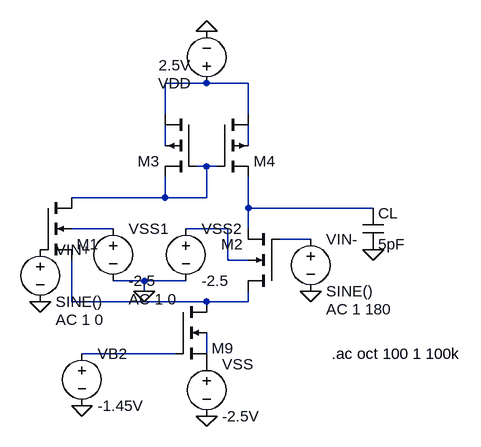
[diagram p0: schematic Jiayi_Feng_2288941F.asc]
Jiayi_Feng_2288941F.asc, the LTspice schematic file:
Version 4
SHEET 1 880 680
WIRE 304 -80 240 -80
WIRE 368 -80 304 -80
WIRE 240 -32 240 -80
WIRE 368 -32 368 -80
WIRE 240 16 240 -16
WIRE 368 16 368 -16
WIRE 304 48 288 48
WIRE 320 48 304 48
WIRE 240 96 240 64
WIRE 240 96 96 96
WIRE 304 96 304 48
WIRE 304 96 240 96
WIRE 368 112 368 64
WIRE 560 112 368 112
WIRE 160 144 96 144
WIRE 336 144 272 144
WIRE 368 144 368 112
WIRE 464 160 416 160
WIRE 336 192 336 144
WIRE 368 192 336 192
WIRE 208 224 160 224
WIRE 272 224 208 224
WIRE 208 240 208 224
WIRE 96 256 96 192
WIRE 304 256 96 256
WIRE 368 256 368 240
WIRE 368 256 304 256
WIRE 256 336 112 336
WIRE 304 336 304 304
FLAG 304 432 0
FLAG 48 256 0
FLAG 304 -160 0
FLAG 464 240 0
FLAG 112 416 0
FLAG 560 176 0
FLAG 208 240 0
SYMBOL cap 544 112 R0
SYMATTR InstName CL
SYMATTR Value 5pF
SYMBOL voltage 304 -64 R180
WINDOW 3 24 44 Left 2
WINDOW 123 0 0 Left 2
WINDOW 39 0 0 Left 2
SYMATTR Value 2.5V
SYMATTR InstName VDD
SYMBOL voltage 304 336 R0
WINDOW 123 0 0 Left 2
WINDOW 39 0 0 Left 2
SYMATTR InstName VSS
SYMATTR Value -2.5V
SYMBOL voltage 48 160 R0
WINDOW 123 24 124 Left 2
WINDOW 39 0 0 Left 2
SYMATTR InstName VIN+
SYMATTR Value SINE()
SYMATTR Value2 AC 1 0
SYMBOL voltage 464 144 R0
WINDOW 123 24 124 Left 2
WINDOW 39 0 0 Left 2
SYMATTR Value2 AC 1 180
SYMATTR InstName VIN-
SYMATTR Value SINE()
SYMBOL voltage 112 320 R0
WINDOW 123 0 0 Left 2
WINDOW 39 0 0 Left 2
SYMATTR InstName VB2
SYMATTR Value -1.45V
SYMBOL pmos4 288 -32 M0
WINDOW 0 56 32 Invisible 2
SYMATTR InstName M5
SYMATTR Value M3
SYMBOL pmos4 320 -32 R0
WINDOW 0 56 32 Invisible 2
SYMATTR InstName M1
SYMATTR Value M4
SYMATTR Value2 l=1.5um w=23um
SYMBOL nmos4 48 96 R0
WINDOW 0 56 32 Invisible 2
SYMATTR InstName M2
SYMATTR Value M1
SYMBOL nmos4 416 240 R180
WINDOW 0 56 32 Invisible 2
SYMATTR InstName M3
SYMATTR Value M2
SYMBOL nmos4 256 256 R0
WINDOW 0 56 32 Invisible 2
SYMATTR InstName M4
SYMATTR Value M9
SYMBOL voltage 160 128 R0
WINDOW 123 24 124 Left 2
WINDOW 39 0 0 Left 2
SYMATTR InstName VSS1
SYMATTR Value -2.5
SYMATTR Value2 AC 1 0
SYMBOL voltage 272 128 R0
WINDOW 123 0 0 Left 2
WINDOW 39 0 0 Left 2
SYMATTR InstName VSS2
SYMATTR Value -2.5
TEXT 496 336 Left 2 !.ac oct 100 1 100k

The netlist it stands for:
* Jiayi_Feng_2288941F.asc
CL N005 0 5pF
VDD N001 0 2.5V
VSS P001 0 -2.5V
VIN+ P002 0 SINE() AC 1 0
VIN- N008 0 SINE() AC 1 180
VB2 N010 0 -1.45V
M5 N001 N004 N004 N002 M3
M1 N001 N004 N005 N003 M4 l=1.5um w=23um
M2 N004 P002 N009 N006 M1
M3 N009 N008 N005 N007 M2
M4 N009 N010 P001 N011 M9
VSS1 N006 0 -2.5 AC 1 0
VSS2 N007 0 -2.5
.model NMOS NMOS
.model PMOS PMOS
.lib standard.mos
.ac oct 100 1 100k
.backanno
.end